# EAGLE design cpm_shield_basic (EAGLE 6.4)
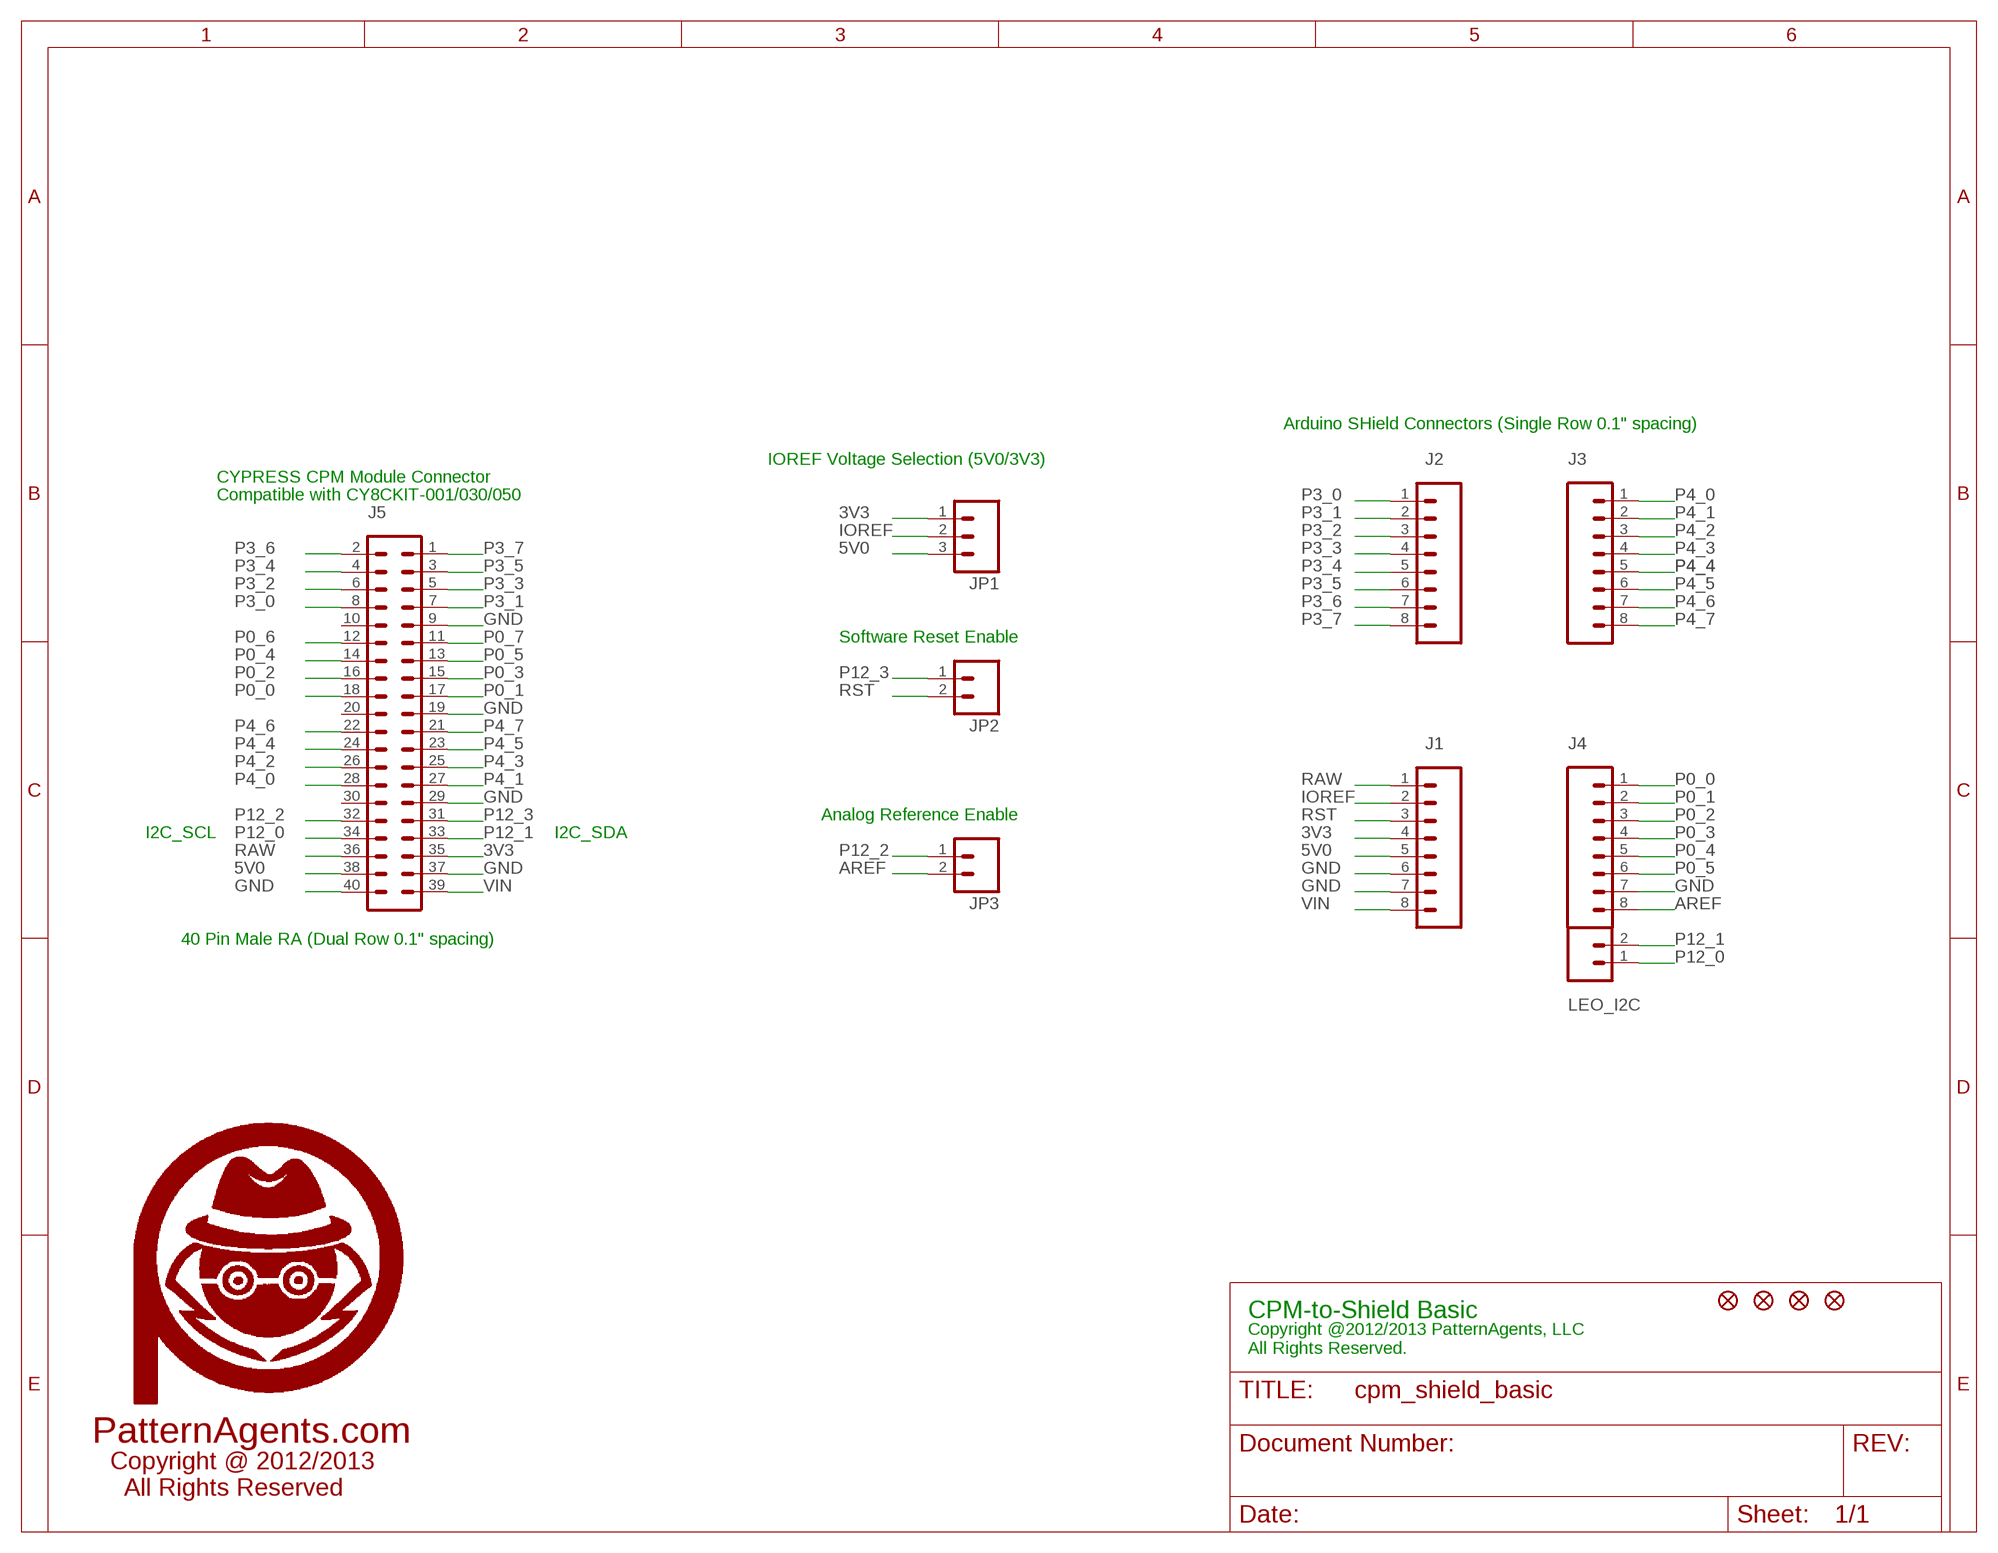
[diagram p0: schematic, sheet 1]

## Parts
J1  SAMTEC  M081X08  [1X08]
J2  SAMTEC  M081X08  [1X08]
J3  SAMTEC  M081X08  [1X08]
J4  SAMTEC  M081X08  [1X08]
J5  SULLINS_SCS  MA20-2  [MA20-2]
JP1  M03PS  [M03]
JP2  M02PS  [MA02]
JP3  M02PS  [MA02]
JP4  FIDUCIAL1.5X3  [FIDUCIAL-1.5X3]
JP5  FIDUCIAL1.5X3  [FIDUCIAL-1.5X3]
JP6  FIDUCIAL1.5X3  [FIDUCIAL-1.5X3]
JP7  FIDUCIAL1.5X3  [FIDUCIAL-1.5X3]
LEO_I2C  M02PS  [MA02]
U$3  LOGO_PA_AGENTLARGE  [LOGO_PA_AGENT_LARGE]

## Nets
3V3: J1.4 J5.35 JP1.1
5V0: J1.5 J5.38 JP1.3
AREF: J4.8 JP3.2
GND: J1.6 J1.7 J4.7 J5.9 J5.19 J5.29 J5.37 J5.40
IOREF: J1.2 JP1.2
P0_0: J4.1 J5.18
P0_1: J4.2 J5.17
P0_2: J4.3 J5.16
P0_3: J4.4 J5.15
P0_4: J4.5 J5.14
P0_5: J4.6 J5.13
P0_6: J5.12
P0_7: J5.11
P3_0: J2.1 J5.8
P3_1: J2.2 J5.7
P3_2: J2.3 J5.6
P3_3: J2.4 J5.5
P3_4: J2.5 J5.4
P3_5: J2.6 J5.3
P3_6: J2.7 J5.2
P3_7: J2.8 J5.1
P4_0: J3.1 J5.28
P4_1: J3.2 J5.27
P4_2: J3.3 J5.26
P4_3: J3.4 J5.25
P4_4: J3.5 J5.24
P4_5: J3.6 J5.23
P4_6: J3.7 J5.22
P4_7: J3.8 J5.21
P12_0: J5.34 LEO_I2C.1
P12_1: J5.33 LEO_I2C.2
P12_2: J5.32 JP3.1
P12_3: J5.31 JP2.1
RAW: J1.1 J5.36
RST: J1.3 JP2.2
VIN: J1.8 J5.39
Unconnected: J5.10 J5.20 J5.30

## Notes on the sheet
- Arduino SHield Connectors (Single Row 0.1" spacing)
- IOREF Voltage Selection (5V0/3V3)
- CYPRESS CPM Module Connector
- Compatible with CY8CKIT-001/030/050
- Software Reset Enable
- Analog Reference Enable
- I2C_SCL | I2C_SDA
- 40 Pin Male RA (Dual Row 0.1" spacing)
- CPM-to-Shield Basic
- Copyright @2012/2013 PatternAgents, LLC
  All Rights Reserved.
- PatternAgents.com
- Copyright @ 2012/2013
    All Rights Reserved

## Library data of the parts
J1-J4 = SparkFun:M08: Header 8 Standard 8-pin 0.1" header. Use with straight break away headers (SKU : PRT-00116), right angle break away headers (PRT-00553), swiss pins (PRT-00743), machine pins (PRT-00117), and female headers (PRT-00115).
J5 = moxdes_V1_0:MA20-2: 40 PIN HEADER; MF: Sullins; MPN: PBC20DBAN; OC_FARNELL: unknown; OC_NEWARK: unknown
JP1 = moxdes_V1_0:M03: Header 3 Standard 3-pin 0.1" header. Use with straight break away headers (SKU : PRT-00116), right angle break away headers (PRT-00553), swiss pins (PRT-00743), machine pins (PRT-00117), and female headers (PRT-00115). Molex polarized connector foot print use with SKU : PRT-08232 with associated crimp pins and housings.
JP2 JP3 LEO_I2C = moxdes_V1_0:M02: Header 2 Standard 2-pin 0.1" header. Use with straight break away headers (SKU : PRT-00116), right angle break away headers (PRT-00553), swiss pins (PRT-00743), machine pins (PRT-00117), and female headers (PRT-00115). Molex polarized connector foot print use with SKU : PRT-08233 with associated crimp pins and housings.
JP4-JP7 = PatternAgents-Misc:FIDUCIAL: Fiducial Alignment Points Various fiducial points for machine vision alignment.
U$3 = PatternAgents-Aesthetics:LOGO_PA_AGENT: PatternAgents Logo Copyright @2012/2013 PatternAgents.com

## Board
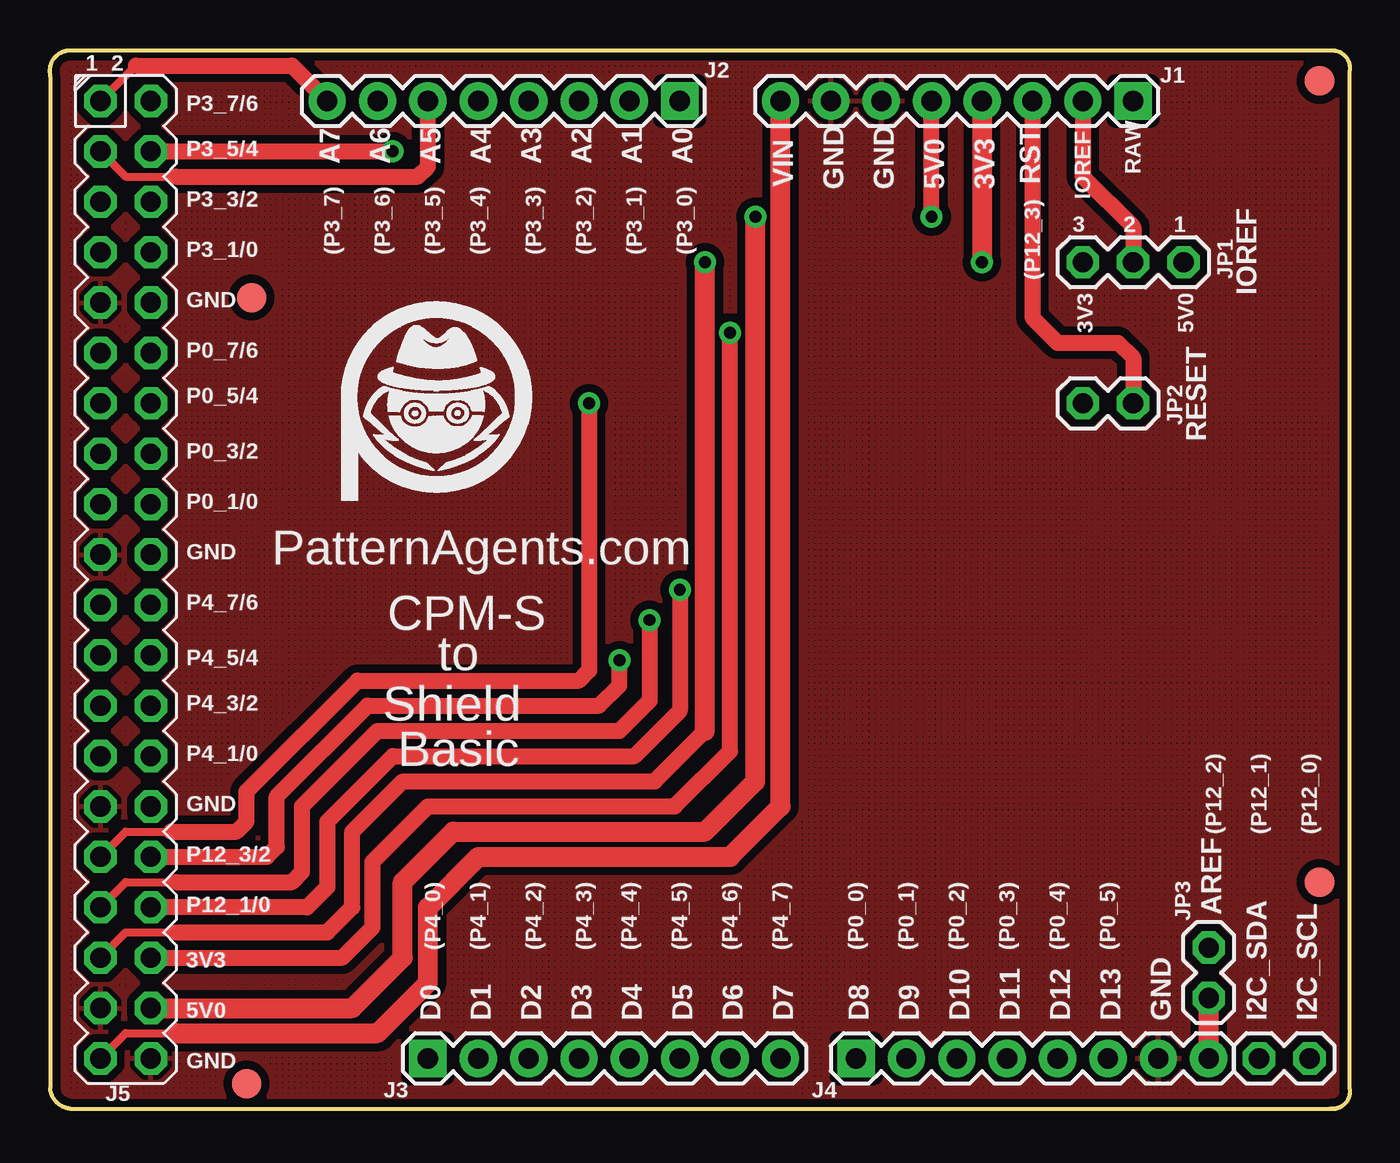
[diagram p1: board, top side]
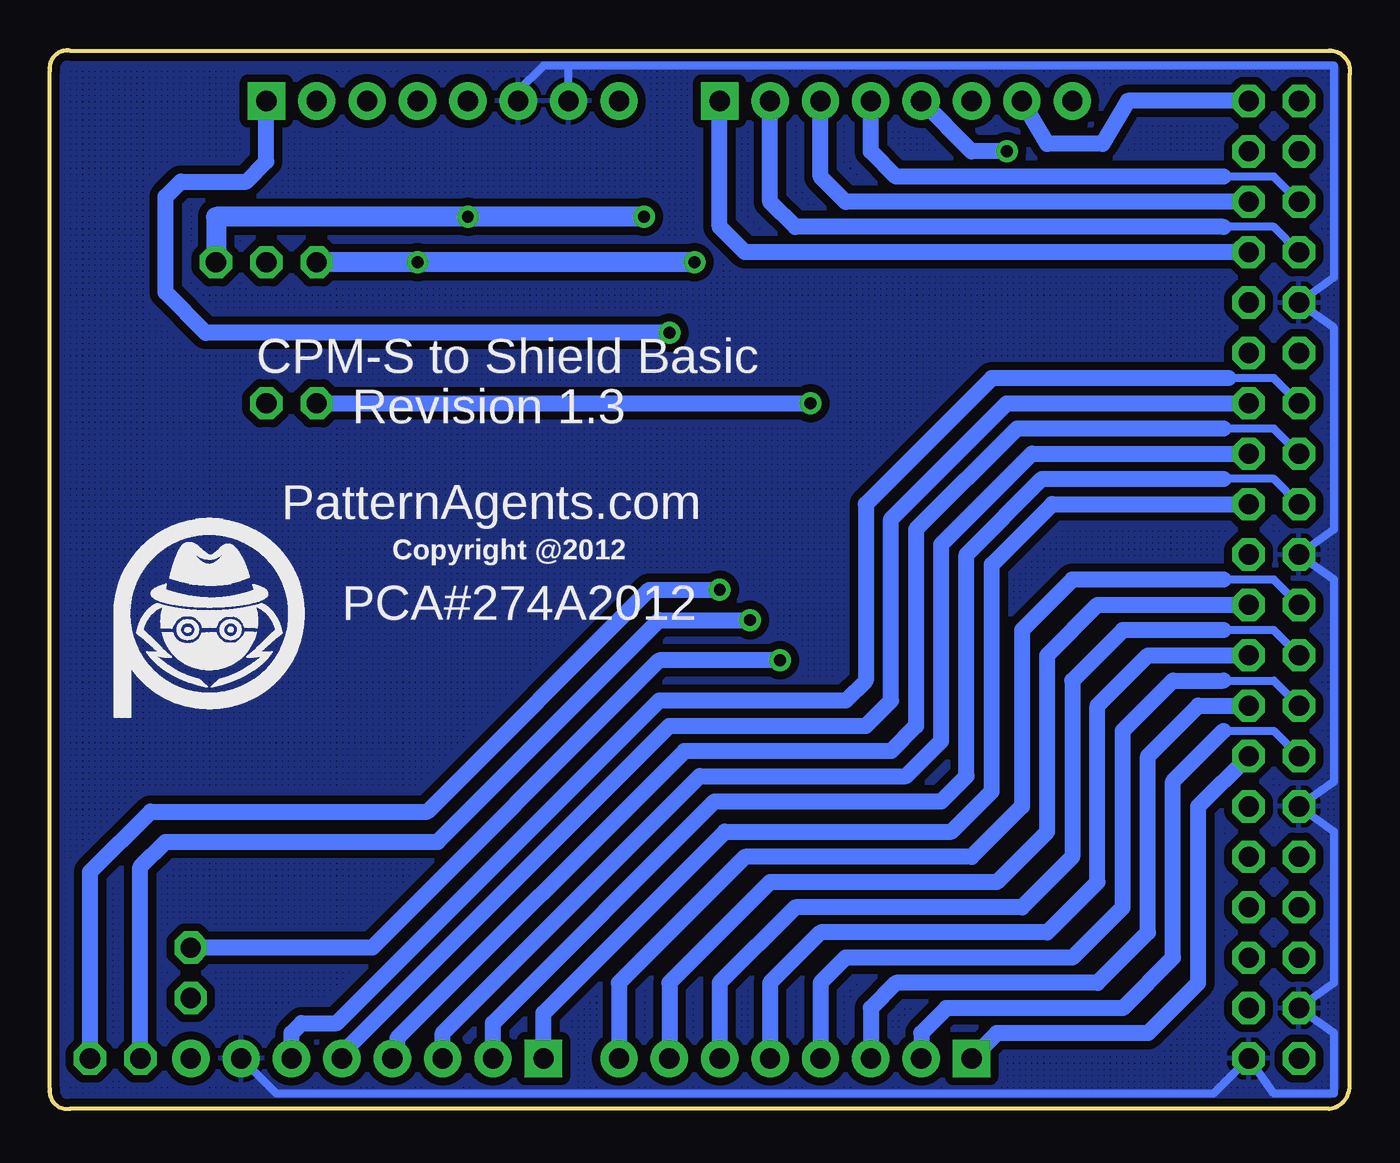
[diagram p2: board, bottom side, seen from below]

Size 65.57 x 53.36 mm. Coordinates in mm from the lower left corner, seen from the top.
Outline: 0.03,52.07 0.03,1.02 arc77 1.04,0.01 64.54,0.01 arc106 65.56,1.02 65.56,52.33 arc106 64.54,53.35 1.04,53.35 arc104 0.03,52.08
Copper layers (1*16): Top 0.035mm / dielectric 1.5mm / Bottom 0.035mm
Design rules "SparkFun": minimum track width 8mil, minimum drill 20mil, track to track 8mil, track to pad 8mil, pad to pad 8mil, via to via 8mil, smd to smd 8mil, copper to edge 10mil, drill to drill 8mil, minimum pad ring 12mil, minimum via ring 10mil, stop-mask expansion 4mil, vias tented up to drill 25mil, thermal gap 10mil

### Footprints (pad centres in the part's own frame; a part is rotated, then mirrored left to right if it is on the bottom)
1X08 = drill 1.016 pad 1.88 square: 1 0,0 | drill 1.016 pad 1.88: 2 2.54,0; 3 5.08,0; 4 7.62,0; 5 10.16,0; 6 12.7,0; 7 15.24,0; 8 17.78,0
MA20-2 = drill 1.016 octagon: 1 -24.13,-1.27; 2 -24.13,1.27; 3 -21.59,-1.27; 4 -21.59,1.27; 5 -19.05,-1.27; 6 -19.05,1.27; 7 -16.51,-1.27; 8 -16.51,1.27; 9 -13.97,-1.27; 10 -13.97,1.27; 11 -11.43,-1.27; 12 -11.43,1.27; 13 -8.89,-1.27; 14 -8.89,1.27; 15 -6.35,-1.27; 16 -6.35,1.27; 17 -3.81,-1.27; 18 -3.81,1.27; 19 -1.27,-1.27; 20 -1.27,1.27; 21 1.27,-1.27; 22 1.27,1.27; 23 3.81,-1.27; 24 3.81,1.27; 25 6.35,-1.27; 26 6.35,1.27; 27 8.89,-1.27; 28 8.89,1.27; 29 11.43,-1.27; 30 11.43,1.27; 31 13.97,-1.27; 32 13.97,1.27; 33 16.51,-1.27; 34 16.51,1.27; 35 19.05,-1.27; 36 19.05,1.27; 37 21.59,-1.27; 38 21.59,1.27; 39 24.13,-1.27; 40 24.13,1.27
M03 = drill 1.016 octagon: 1 0,0; 2 2.54,0; 3 5.08,0
MA02 = drill 1.016 octagon: 1 0,0; 2 2.54,0
FIDUCIAL-1.5X3 = smd 1.5 x 1.5: 1 0,0

### Placement (x,y rotation side)
J1  54.64,50.81 180 top
J2  31.78,50.81 180 top
J3  19.08,2.55 0 top
J4  40.67,2.55 0 top
J5  3.84,26.68 270 top
JP1  52.1,42.68 0 top
JP2  52.1,35.57 0 top
JP3  58.45,8.14 270 top
JP4  64.04,51.82 0 top
JP5  9.93,1.28 0 top
JP6  64.04,11.44 0 top
JP7  10.19,40.9 0 top
LEO_I2C  63.53,2.55 180 top
U$2  [LOGO_PA_AGENT_LARGE]  57.43,24.14 0 bottom
U$3  19.59,35.06 0 top

### Tracks (layer width: path | path; a pad name or v marks a point on that pad's centre or on a via)
3V3  (via drill 0.6)
  Top 0.406: J5.35 3.84,8.9 6.38,8.9
  Top 0.813: 6.38,8.9 14,8.9 15.27,10.17 15.27,13.98 17.81,16.52 30.51,16.52 33.05,19.06
  Top 1.016: 33.05,19.06 v33.05,42.68 | J1.4 v47.02,42.68
  Bottom 1.016: v33.05,42.68 v47.02,42.68 JP1.1
5V0  (via drill 0.6)
  Top 0.813: v44.48,44.97 J1.5
  Top 1.016: v35.59,44.97 35.59,16.52 33.05,13.98 20.35,13.98 17.81,11.44 17.81,7.63 15.27,5.09 J5.38
  Bottom 1.016: v35.59,44.97 v44.48,44.97 57.18,44.97 JP1.3
AREF
  Top 1.016: J4.8 JP3.2
GND
  Top 0.203: 38.13,3.31 38.14,3.31 | J4.7 55.65,2.29 55.78,2.29 | 44.48,3.31 44.5,3.38
  Bottom 0.406: 39.4,52.59 0.79,52.59 0.79,41.92 J5.9 0.79,39.38 0.79,29.22 J5.19 0.79,26.68 0.79,16.52 J5.29 0.79,13.98 0.79,6.36 J5.37 0.79,3.82 0.79,0.77 3.84,0.77 J5.40 6.89,0.77 54.13,0.77 J4.7 | 39.4,52.59 40.67,52.59 41.94,51.32 J1.6 | J1.7 39.4,52.59
  pour Top (isolate 0.406, hatched): 0.03,53.35 65.56,53.35 65.56,0.01 0.03,0.01
  pour Bottom (isolate 0.406, hatched): 0.03,53.35 65.56,53.35 65.56,0.01 0.03,0.01
IOREF
  Top 0.813: J1.2 52.1,47 54.64,44.46 JP1.2
P0_0
  Bottom 0.813: J4.1 40.67,4.83 31.52,13.98 20.09,13.98 18.06,16.01 18.06,27.44 15.01,30.49 J5.18
P0_1
  Bottom 0.406: J5.17 3.84,31.76 6.38,31.76
  Bottom 0.813: J4.2 43.21,4.33 32.03,15.5 20.6,15.5 19.33,16.77 19.33,27.95 15.52,31.76 6.38,31.76
P0_2
  Bottom 0.813: J4.3 45.75,3.82 32.79,16.77 22.38,16.77 20.6,18.55 20.6,28.46 16.03,33.03 J5.16
P0_3
  Bottom 0.406: J5.15 3.84,34.3 6.38,34.3
  Bottom 0.813: 6.38,34.3 16.79,34.3 21.87,29.22 21.87,19.31 23.14,18.04 33.56,18.04 48.03,3.56 48.03,2.8 J4.4
P0_4
  Bottom 0.813: J4.5 50.83,2.8 34.32,19.31 24.41,19.31 23.14,20.58 23.14,29.73 17.3,35.57 J5.14
P0_5
  Bottom 0.406: J5.13 3.84,36.84 6.12,36.84
  Bottom 0.813: 6.12,36.84 18.06,36.84 24.41,30.49 24.41,21.6 25.43,20.58 34.83,20.58 51.08,4.33 52.86,4.33 53.37,3.82 J4.6
P3_0
  Bottom 0.813: J5.8 30.51,43.19 31.78,44.46 J2.1
P3_1
  Bottom 0.406: J5.7 3.84,44.46 6.38,44.46
  Bottom 0.813: J2.2 29.24,45.73 27.97,44.46 6.38,44.46
P3_2
  Bottom 0.813: J5.6 25.43,45.73 26.7,47 J2.3
P3_3
  Bottom 0.406: J5.5 3.84,47 6.38,47
  Bottom 0.813: J2.4 24.16,48.27 22.89,47 6.38,47
P3_4  (via drill 0.6)
  Top 0.813: J5.4 v17.3,48.27
  Bottom 0.813: v17.3,48.27 19.08,48.27 J2.5
P3_5
  Top 0.406: J5.3 3.84,47 6.38,47
  Top 0.813: J2.6 19.08,47.51 18.57,47 6.38,47
P3_6
  Bottom 0.813: J5.2 11.2,50.81 12.47,48.65 15.27,48.65 J2.7
P3_7
  Top 0.406: J5.1 4.35,52.59
  Top 0.813: 4.35,52.59 12.22,52.59 J2.8
P4_0
  Bottom 0.813: J5.28 7.65,15.25 7.65,6.36 10.19,3.82 17.81,3.82 J3.1
P4_1
  Bottom 0.406: J5.27 3.84,19.06 6.38,19.06
  Bottom 0.813: 6.38,19.06 8.92,16.52 8.92,7.63 11.46,5.09 20.35,5.09 21.62,3.82 J3.2
P4_2
  Bottom 0.813: J5.26 7.65,20.33 10.19,17.79 10.19,8.9 12.73,6.36 22.89,6.36 24.16,5.09 J3.3
P4_3
  Bottom 0.406: J5.25 3.84,21.6 6.38,21.6
  Bottom 0.813: 6.38,21.6 8.92,21.6 11.46,19.06 11.46,10.17 14,7.63 25.43,7.63 26.7,6.36 J3.4
P4_4
  Bottom 0.813: J5.24 10.19,22.87 12.73,20.33 12.73,11.44 15.27,8.9 26.7,8.9 29.24,6.36 J3.5
P4_5
  Bottom 0.406: J5.23 3.84,24.14 6.38,24.14
  Bottom 0.813: 6.38,24.14 11.46,24.14 14,21.6 14,12.71 16.54,10.17 27.97,10.17 31.78,6.36 J3.6
P4_6
  Bottom 0.813: J5.22 12.73,25.41 15.27,22.87 15.27,13.98 17.81,11.44 29.24,11.44 34.32,6.36 J3.7
P4_7
  Bottom 0.406: J5.21 3.84,26.68 6.38,26.68
  Bottom 0.813: 6.38,26.68 14,26.68 16.54,24.14 16.54,15.25 19.08,12.71 30.51,12.71 36.86,6.36 J3.8
P12_0  (via drill 0.6)
  Top 0.813: J5.34 12.98,10.17 14,11.18 14,14.49 17.3,17.79 29.49,17.79 31.78,20.07 v31.78,26.17
  Bottom 0.813: LEO_I2C.1 63.53,11.95 60.48,14.99 46.51,14.99 35.33,26.17 v31.78,26.17
P12_1  (via drill 0.6)
  Top 0.406: J5.33 3.84,11.44 6.38,11.44
  Top 0.813: 6.38,11.44 12.22,11.44 12.73,11.95 12.73,15.25 16.54,19.06 28.73,19.06 30.25,20.58 v30.25,24.65
  Bottom 0.813: LEO_I2C.2 60.99,12.2 59.72,13.47 46,13.47 34.83,24.65 v30.25,24.65
P12_2  (via drill 0.6)
  Top 0.813: J5.32 10.95,12.71 11.46,13.22 11.46,15.76 16.03,20.33 27.71,20.33 28.73,21.34 v28.73,22.61
  Bottom 0.813: v28.73,22.61 34.83,22.61 49.3,8.14 JP3.1
P12_3  (via drill 0.6)
  Top 0.406: J5.31 3.84,13.98 6.12,13.98
  Top 0.813: 6.12,13.98 9.43,13.98 9.93,14.49 9.93,16.01 15.52,21.6 26.7,21.6 27.21,22.11 v27.21,35.57
  Bottom 0.813: JP2.1 v27.21,35.57
RAW  (via drill 0.6)
  Top 0.813: J5.36 14.76,7.63 16.28,9.15 16.28,12.45 19.08,15.25 31.52,15.25 34.32,18.04 v34.32,39.12
  Bottom 0.813: v34.32,39.12 57.69,39.12 59.72,41.16 59.72,45.98 58.96,46.74 55.65,46.74 54.64,47.76 J1.1
RST
  Top 0.813: J1.3 49.56,39.89 50.83,38.62 53.88,38.62 54.64,37.85 JP2.2
VIN
  Top 0.406: J5.39 3.84,3.82 6.38,3.82
  Top 1.016: 6.38,3.82 16.54,3.82 19.08,6.36 19.08,10.17 21.62,12.71 34.32,12.71 36.86,15.25 J1.8

### Text on the board
tPlace: 1 2 | P3_7/6 | P3_5/4 | A7 | A6 | A5 | A4 | A3 | A2 | A1 | A0 | RST | RAW | VIN | GND | GND | 5V0 | 3V3 | IOREF | P3_3/2 | 3 | 2 | 1 | P3_1/0 | (P3_7) | (P3_6) | (P3_5) | (P3_4) | (P3_3) | (P3_2) | (P3_1) | (P3_0) | (P12_3) | IOREF | GND | 3V3 | 5V0 | P0_7/6 | P0_5/4 | RESET | P0_3/2 | P0_1/0 | GND | PatternAgents.com | CPM-S | P4_7/6 | P4_5/4 | to | P4_3/2 | Shield | P4_1/0 | Basic | GND | (P12_2) | (P12_1) | (P12_0) | P12_3/2 | P12_1/0 | AREF | (P4_0) | (P4_1) | (P4_2) | (P4_3) | (P4_4) | (P4_5) | (P4_6) | (P4_7) | (P0_0) | (P0_1) | (P0_2) | (P0_3) | (P0_4) | (P0_5) | 3V3 | 5V0 | D0 | D1 | D2 | D3 | D4 | D5 | D6 | D7 | D8 | D9 | D10 | D11 | D12 | D13 | GND | I2C_SDA | I2C_SCL | GND
bPlace: CPM-S to Shield Basic | Revision 1.3 | PatternAgents.com | Copyright @2012 | PCA#274A2012